# Altium schematic sheet STM32F103_2.SchDoc
size A3
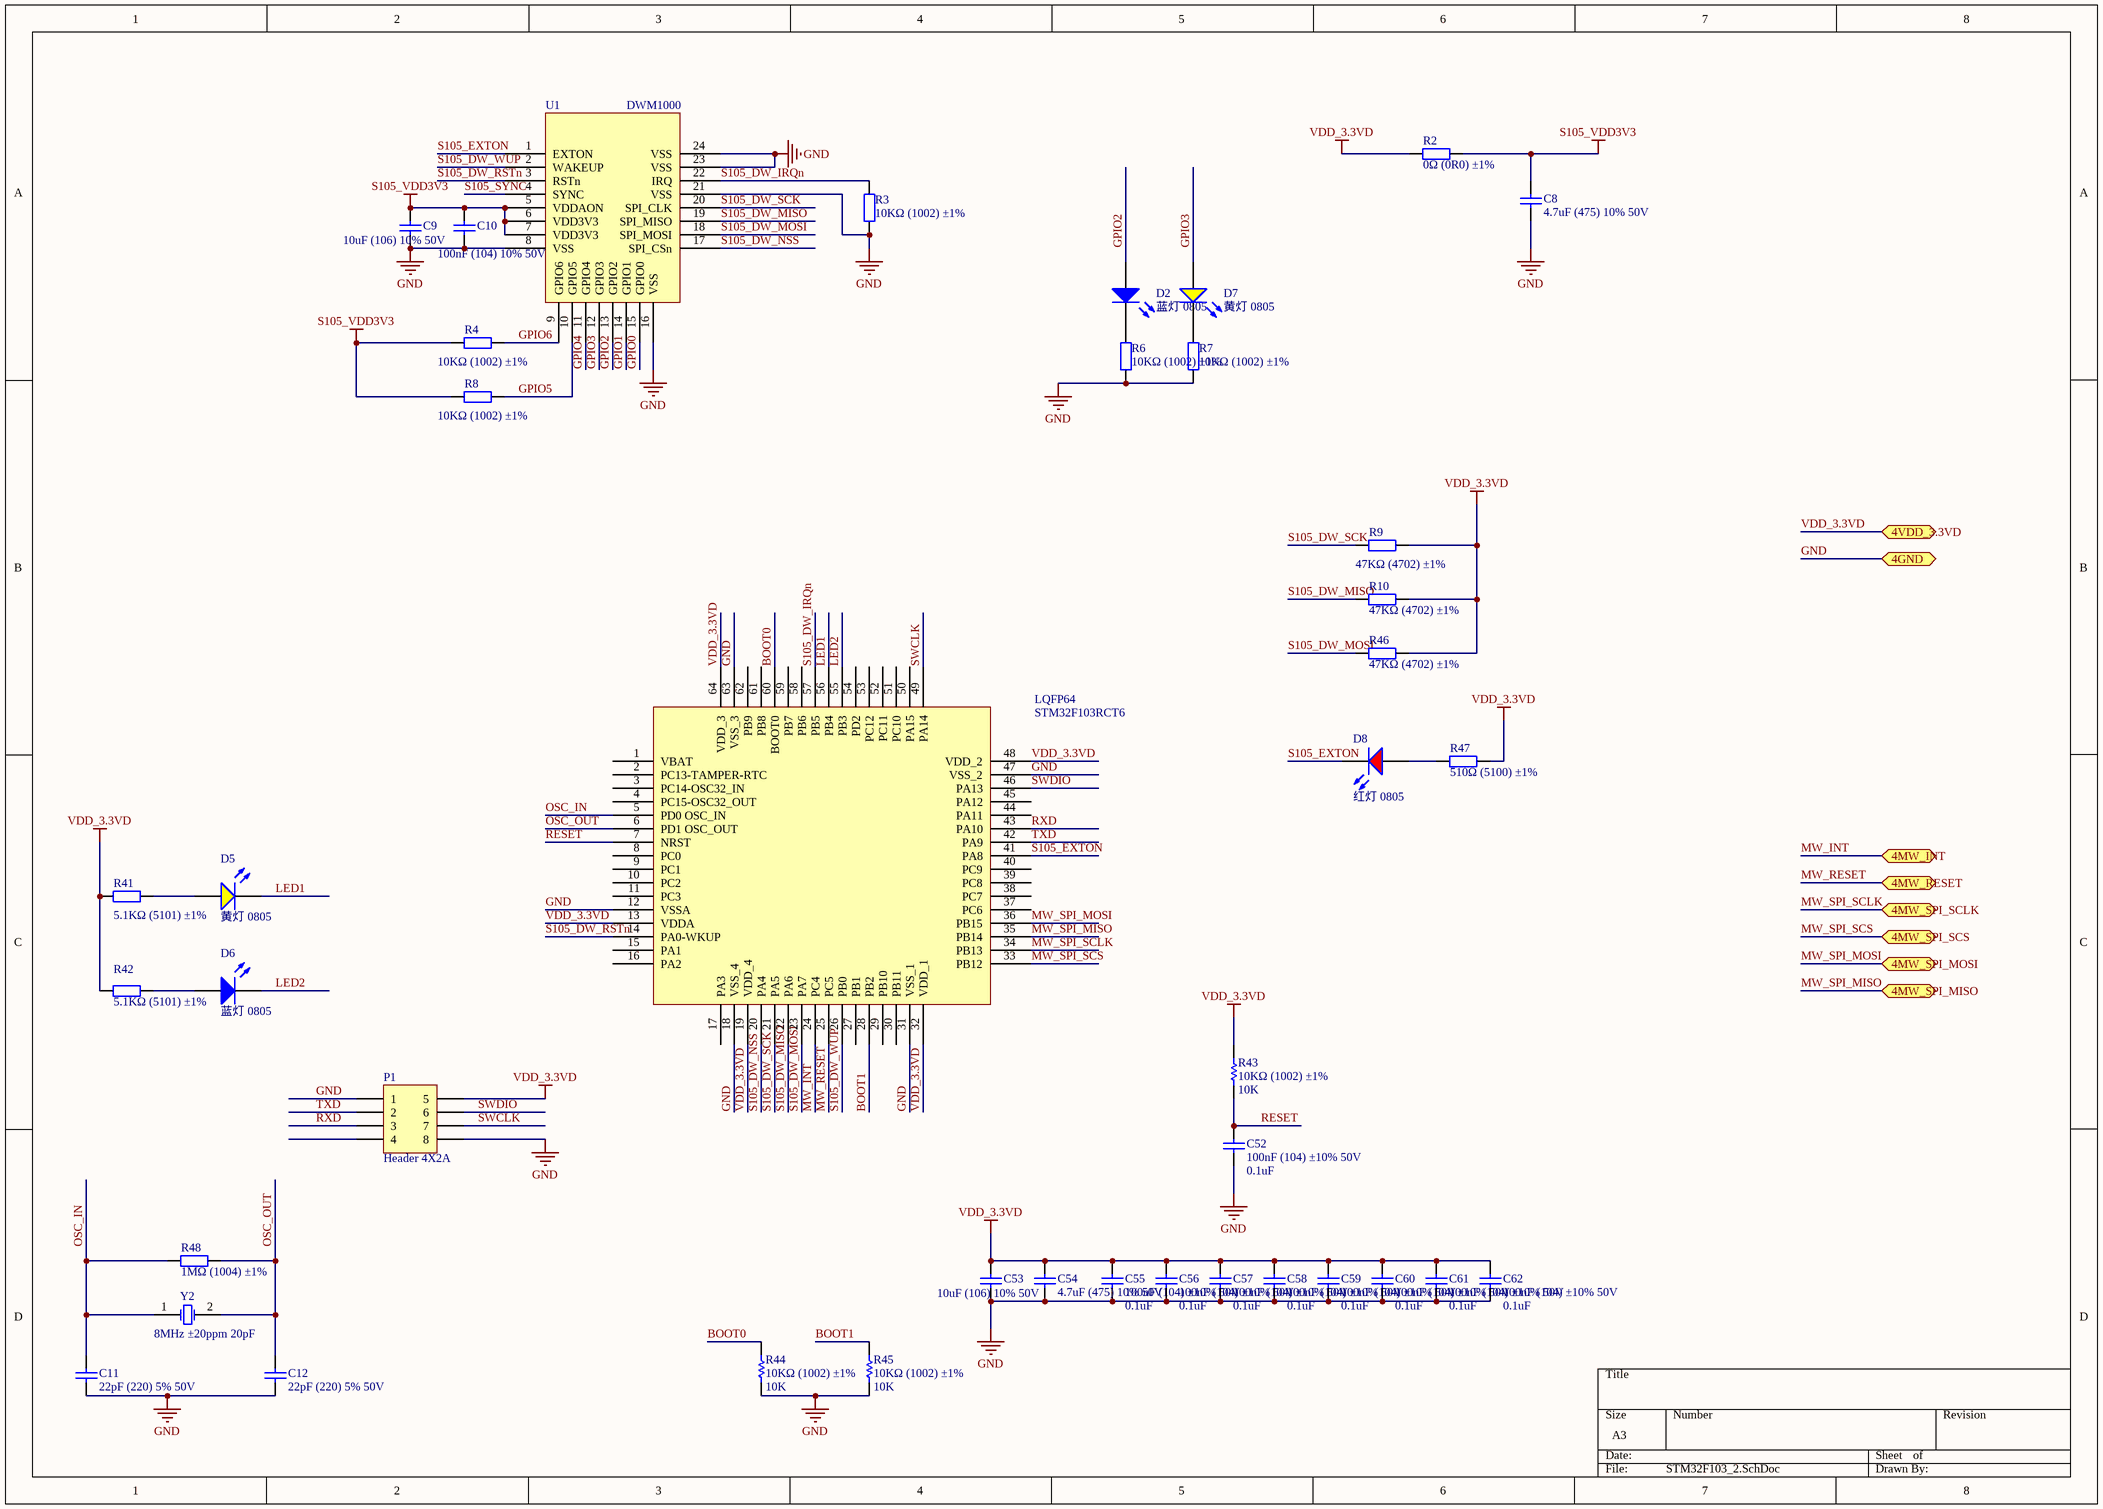
[diagram p0: STM32F103_2.SchDoc]

## Parts
C8  4.7uF (475) 10% 50V  [1206_C]
C9  10uF (106) 10% 50V  [1206_C]
C10  100nF (104) 10% 50V  [0603_C]
C11  22pF (220) 5% 50V  [0603_C]
C12  22pF (220) 5% 50V  [0603_C]
C52  100nF (104) ±10% 50V  value 0.1uF  [1608[0603]]
C53  10uF (106) 10% 50V  [1206_C]
C54  4.7uF (475) 10% 50V  [1206_C]
C55  100nF (104) ±10% 50V  value 0.1uF  [1608[0603]]
C56  100nF (104) ±10% 50V  value 0.1uF  [1608[0603]]
C57  100nF (104) ±10% 50V  value 0.1uF  [1608[0603]]
C58  100nF (104) ±10% 50V  value 0.1uF  [1608[0603]]
C59  100nF (104) ±10% 50V  value 0.1uF  [1608[0603]]
C60  100nF (104) ±10% 50V  value 0.1uF  [1608[0603]]
C61  100nF (104) ±10% 50V  value 0.1uF  [1608[0603]]
C62  100nF (104) ±10% 50V  value 0.1uF  [1608[0603]]
D2  蓝灯 0805  [0805_LED_S1]
D5  黄灯 0805  [0805_LED_S1]
D6  蓝灯 0805  [0805_LED_S1]
D7  黄灯 0805  [0805_LED_S1]
D8  红灯 0805  [0805_LED_S1]
LQFP64  STM32F103RCT6  [LQFP64]
P1  Header 4X2A  [HDR2X4_CEN]
R2  0Ω (0R0) ±1%  [1206_R]
R3  10KΩ (1002) ±1%  [0603_R]
R4  10KΩ (1002) ±1%  [0603_R]
R6  10KΩ (1002) ±1%  [0603_R]
R7  10KΩ (1002) ±1%  [0603_R]
R8  10KΩ (1002) ±1%  [0603_R]
R9  47KΩ (4702) ±1%  [0603_R]
R10  47KΩ (4702) ±1%  [0603_R]
R41  5.1KΩ (5101) ±1%  [0603_R]
R42  5.1KΩ (5101) ±1%  [0603_R]
R43  10KΩ (1002) ±1%  value 10K  [1608[0603]]
R44  10KΩ (1002) ±1%  value 10K  [1608[0603]]
R45  10KΩ (1002) ±1%  value 10K  [1608[0603]]
R46  47KΩ (4702) ±1%  [0603_R]
R47  510Ω (5100) ±1%  [0603_R]
R48  1MΩ (1004) ±1%  [0603_R]
U1  DWM1000  [DWM1000]
Y2  8MHz ±20ppm 20pF  [SMD-5032_2P]

## Ports
4GND, 4MW_INT, 4MW_RESET, 4MW_SPI_MISO, 4MW_SPI_MOSI, 4MW_SPI_SCLK, 4MW_SPI_SCS, 4VDD_3.3VD

## Nets
GND: C8.1 C9.1 C10.1 C11.1 C12.1 C52.1 C53.1 C54.1 C55.1 C56.1 C57.1 C58.1 C59.1 C60.1 C61.1 C62.1 LQFP64.12(VSSA) LQFP64.18(VSS_4) LQFP64.31(VSS_1) LQFP64.47(VSS_2) LQFP64.63(VSS_3) P1.1 P1.8 R3.1 R6.1 R7.1 R44.1 R45.1 U1.8(VSS) U1.16(VSS) U1.21(VSS) U1.23(VSS) U1.24(VSS) ; port 4GND
S105_VDD3V3: C8.2 C9.2 C10.2 R2.2 R4.1 R8.1 U1.5(VDDAON) U1.6(VDD3V3) U1.7(VDD3V3)
VDD_3.3VD: C53.2 C54.2 C55.2 C56.2 C57.2 C58.2 C59.2 C60.2 C61.2 C62.2 LQFP64.13(VDDA) LQFP64.19(VDD_4) LQFP64.32(VDD_1) LQFP64.48(VDD_2) LQFP64.64(VDD_3) P1.5 R2.1 R9.2 R10.2 R41.1 R42.1 R43.2 R46.2 R47.2 ; port 4VDD_3.3VD
BOOT0: LQFP64.60(BOOT0) R44.2
BOOT1: LQFP64.28(PB2) R45.2
GPIO0: U1.15(GPIO0)
GPIO1: U1.14(GPIO1)
GPIO2: D2.A U1.13(GPIO2)
GPIO3: D7.A U1.12(GPIO3)
GPIO4: U1.11(GPIO4)
GPIO5: R8.2 U1.10(GPIO5)
GPIO6: R4.2 U1.9(GPIO6)
LED1: D5.K LQFP64.56(PB4)
LED2: D6.K LQFP64.55(PB3)
MW_INT: LQFP64.24(PC4) ; port 4MW_INT
MW_RESET: LQFP64.25(PC5) ; port 4MW_RESET
MW_SPI_MISO: LQFP64.35(PB14) ; port 4MW_SPI_MISO
MW_SPI_MOSI: LQFP64.36(PB15) ; port 4MW_SPI_MOSI
MW_SPI_SCLK: LQFP64.34(PB13) ; port 4MW_SPI_SCLK
MW_SPI_SCS: LQFP64.33(PB12) ; port 4MW_SPI_SCS
OSC_IN: C11.2 LQFP64.5(PD0_OSC_IN) R48.1 Y2.1(OSC1)
OSC_OUT: C12.2 LQFP64.6(PD1_OSC_OUT) R48.2 Y2.2(OSC2)
RESET: C52.2 LQFP64.7(NRST) R43.1
RXD: LQFP64.43(PA10) P1.3
S105_DW_IRQn: LQFP64.57(PB5) R3.2 U1.22(IRQ)
S105_DW_MISO: LQFP64.22(PA6) R10.1 U1.19(SPI_MISO)
S105_DW_MOSI: LQFP64.23(PA7) R46.1 U1.18(SPI_MOSI)
S105_DW_NSS: LQFP64.20(PA4) U1.17(SPI_CSn)
S105_DW_RSTn: LQFP64.14(PA0-WKUP) U1.3(RSTn)
S105_DW_SCK: LQFP64.21(PA5) R9.1 U1.20(SPI_CLK)
S105_DW_WUP: LQFP64.26(PB0) U1.2(WAKEUP)
S105_EXTON: D8.K LQFP64.41(PA8) U1.1(EXTON)
S105_SYNC: U1.4(SYNC)
SWCLK: LQFP64.49(PA14) P1.7
SWDIO: LQFP64.46(PA13) P1.6
TXD: LQFP64.42(PA9) P1.2
NetD2_K: D2.K R6.2
NetD5_A: D5.A R41.2
NetD6_A: D6.A R42.2
NetD7_K: D7.K R7.2
NetD8_A: D8.A R47.1

Not connected (* = marked no-connect by the designer): LQFP64 1(VBAT) 2(PC13-TAMPER-RTC) 3(PC14-OSC32_IN) 4(PC15-OSC32_OUT) 8(PC0) 9(PC1) 10(PC2) 11(PC3) 15(PA1) 16(PA2) 17(PA3) 27(PB1) 29(PB10) 30(PB11) 37(PC6) 38(PC7) 39(PC8) 40(PC9) 44(PA11) 45(PA12) 50(PA15) 51(PC10) 52(PC11) 53(PC12) 54(PD2) 58(PB6) 59(PB7) 61(PB8) 62(PB9); P1 4

## Library data of the parts
C8 C54 = 1206 4.7uF (475) 10% 50V: 贴片电容; ComponentLink1Description: 供应商链接; ComponentLink1URL: http://www.szlcsc.com/product/details_30577.html; Package: 1206; Supplier: LC; SuppliersPartNumber: C29823
C9 C53 = 1206 10uF (106) 10% 50V: 贴片电容; ComponentLink1Description: 供应商链接; ComponentLink1URL: http://www.szlcsc.com/product/details_14236.html; Package: 1206; Supplier: LC; SuppliersPartNumber: C13585
C10 = 0603 100nF (104) 10% 50V: 贴片电容; ComponentLink1Description: 供应商链接; ComponentLink1URL: http://www.szlcsc.com/product/details_15331.html; Package: 0603; Supplier: LC; SuppliersPartNumber: C14663
C11 C12 = 0603 22pF (220) 5% 50V: 贴片电容; ComponentLink1Description: 供应商链接; ComponentLink1URL: http://www.szlcsc.com/product/details_2005.html; Package: 0603; Supplier: LC; SuppliersPartNumber: C1653
C52 C55-C62 = Cap: Capacitor; Published: 8-Jun-2000; LatestRevisionDate: 17-Jul-2002; LatestRevisionNote: Re-released for DXP Platform.; PackageReference: RAD-0.3; Publisher: Altium Limited; PackageDescription: Radial Cap, Thru-Hole; 2 Leads; 0.3 in Pin Spacing
D2 D6 = 0805 蓝灯: 发光二极管; ComponentLink1Description: 供应商链接; ComponentLink1URL: http://www.szlcsc.com/product/details_2666.html; Package: 0805; Supplier: LC; SuppliersPartNumber: C2293
D5 D7 = 0805 黄灯: 发光二极管; ComponentLink1Description: 供应商链接; ComponentLink1URL: http://www.szlcsc.com/product/details_2669.html; Package: 0805; Supplier: LC; SuppliersPartNumber: C2296
D8 = 0805 红灯: 发光二极管; ComponentLink1Description: 供应商链接; ComponentLink1URL: http://www.szlcsc.com/product/details_2668.html; Package: 0805; Supplier: LC; SuppliersPartNumber: C2295
P1 = Header 4X2A: Header, 4-Pin, Dual row; LatestRevisionDate: 17-Jul-2002; LatestRevisionNote: Re-released for DXP Platform.; Publisher: Altium Limited
R2 = 1206 0Ω (0R0) 1%: 贴片电阻; ComponentLink1Description: 供应商链接; ComponentLink1URL: http://www.szlcsc.com/product/details_18576.html; Package: 1206; Supplier: LC; SuppliersPartNumber: C17888
R3 R4 R6-R8 = 0603 10KΩ (1002) 1%: 贴片电阻; ComponentLink1Description: 供应商链接; ComponentLink1URL: http://www.szlcsc.com/product/details_26547.html; Package: 0603; Supplier: LC; SuppliersPartNumber: C25804
R9 R10 R46 = 0603 47KΩ (4702) 1%: 贴片电阻; ComponentLink1Description: 供应商链接; ComponentLink1URL: http://www.szlcsc.com/product/details_26562.html; Package: 0603; Supplier: LC; SuppliersPartNumber: C25819
R41 R42 = 0603 5.1KΩ (5101) 1%: 贴片电阻; ComponentLink1Description: 供应商链接; ComponentLink1URL: http://www.szlcsc.com/product/details_23913.html; Package: 0603; Supplier: LC; SuppliersPartNumber: C23186
R43-R45 = Res1: Resistor; Published: 8-Jun-2000; LatestRevisionDate: 17-Jul-2002; LatestRevisionNote: Re-released for DXP Platform.; PackageReference: AXIAL-0.3; Publisher: Altium Limited; PackageDescription: Axial Device, Thru-Hole; 2 Leads; 0.3 in Pin Spacing
R47 = 0603 510Ω (5100) 1%: 贴片电阻; ComponentLink1Description: 供应商链接; ComponentLink1URL: http://www.szlcsc.com/product/details_23920.html; Package: 0603; Supplier: LC; SuppliersPartNumber: C23193
R48 = 0603 1MΩ (1004) 1%: 贴片电阻; ComponentLink1Description: 供应商链接; ComponentLink1URL: http://www.szlcsc.com/product/details_23662.html; Package: 0603; Supplier: LC; SuppliersPartNumber: C22935
Y2 = SMD-5032_2P 8MHz 20ppm 20pF: 贴片晶振; ComponentLink1Description: 供应商链接; ComponentLink1URL: http://www.szlcsc.com/product/details_117214.html; Package: SMD-5032_2P; Supplier: LC; SuppliersPartNumber: C115962